# EAGLE design ms1616 (EAGLE 6.2)

## Sheet 1 of 3
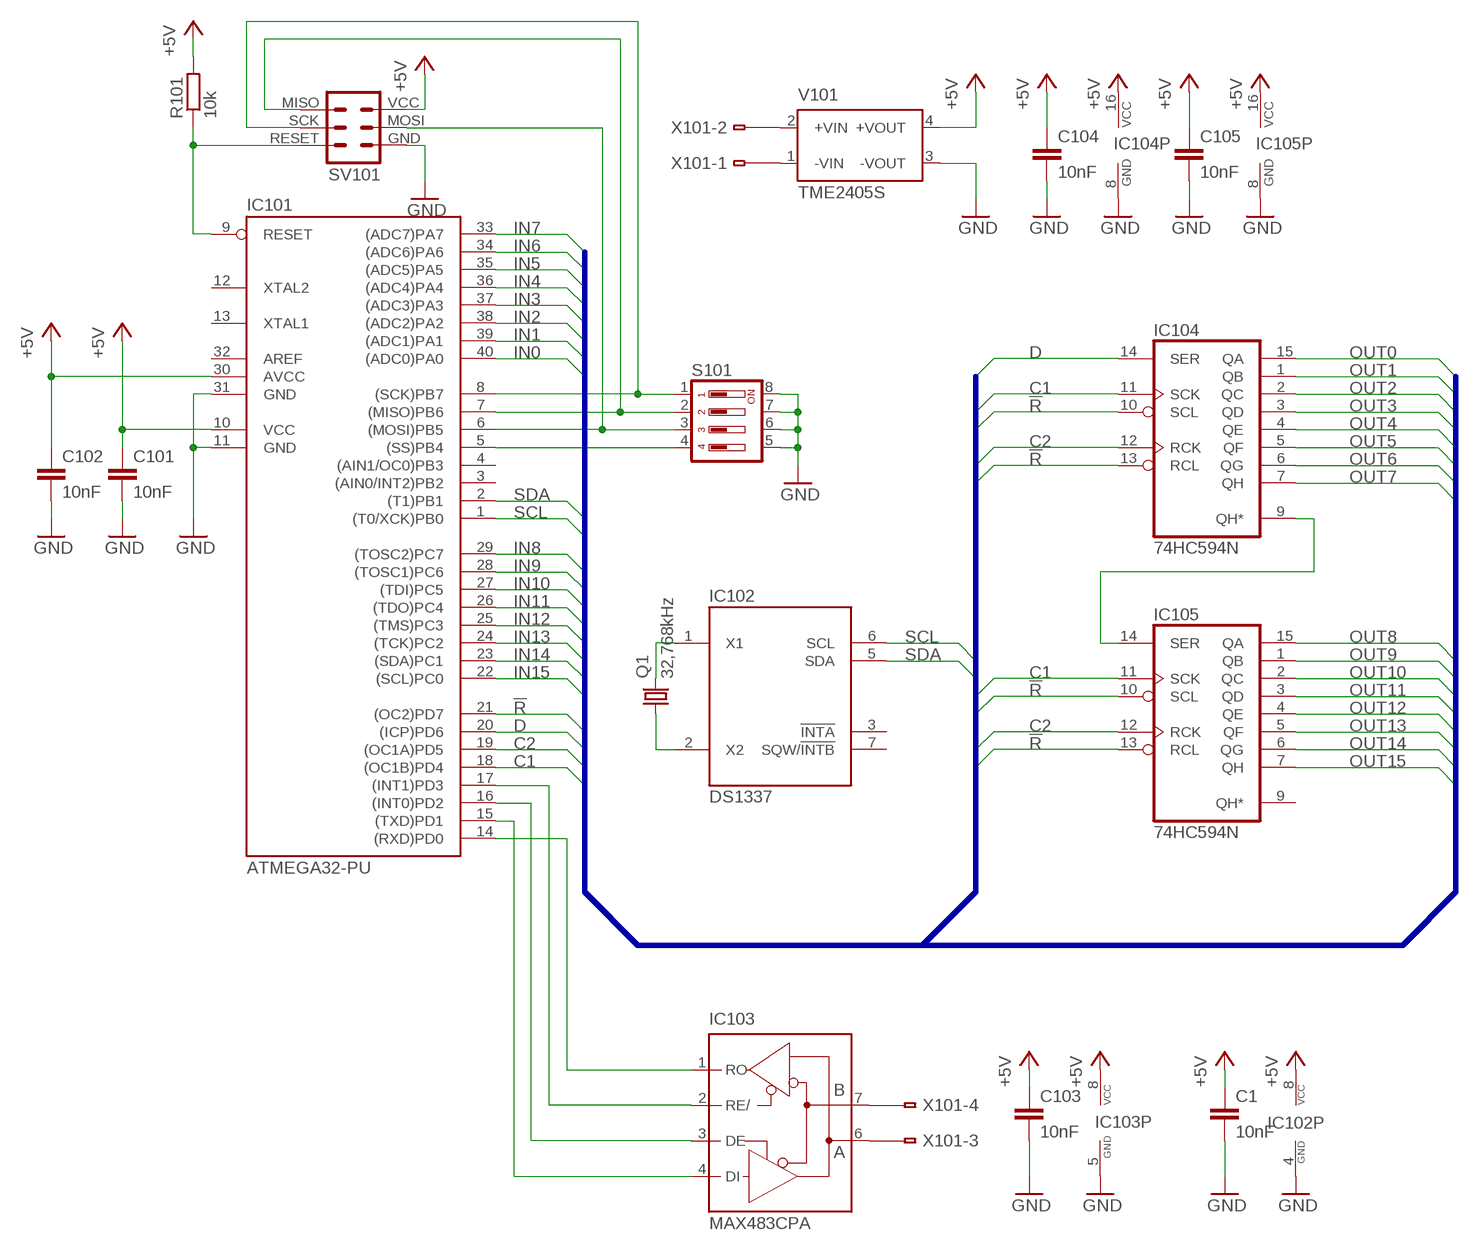
[diagram p0: schematic, sheet 1]

### Parts
C1  10nF  C_025-025X050  [C025-025X050]
C101  10nF  C_025-025X050  [C025-025X050]
C102  10nF  C_025-025X050  [C025-025X050]
C103  10nF  C_025-025X050  [C025-025X050]
C104  10nF  C_025-025X050  [C025-025X050]
C105  10nF  C_025-025X050  [C025-025X050]
IC101  ATMEGA32-PU  [DIL40]
IC102  DS1337  [DIL08]
IC103  MAX483CPA  [DIL08]
IC104  74HC594N  [DIL16]
IC105  74HC594N  [DIL16]
Q1  32,768kHz  Q_HC49S  [HC49/S]
R101  10k  R_0204/2V  [0204V]
S101  DIP04YL  [DIP04YL]
SV101  AVR_ISP6  [ML6]
V101  TME2405S  [TME-24V]
X101  233-504  [233-504]

### Nets
!R: IC101.21((OC2)PD7) IC104.10(SCL) IC104.13(RCL) IC105.10(SCL) IC105.13(RCL)
+5V: C1.1 C101.1 C102.1 C103.1 C104.1 C105.1 IC101.10(VCC) IC101.30(AVCC) IC102.8(VCC) IC103.8(VCC) IC104.16(VCC) IC105.16(VCC) R101.2 SV101.VCC V101.4(+VOUT)
C1: IC101.18((OC1B)PD4) IC104.11(SCK) IC105.11(SCK)
C2: IC101.19((OC1A)PD5) IC104.12(RCK) IC105.12(RCK)
D: IC101.20((ICP)PD6) IC104.14(SER)
GND: C1.2 C101.2 C102.2 C103.2 C104.2 C105.2 IC101.11(GND) IC101.31(GND) IC102.4(GND) IC103.5(GND) IC104.8(GND) IC105.8(GND) S101.5 S101.6 S101.7 S101.8 SV101.GND V101.3(-VOUT) ; also sheet 2,3
IN0: IC101.40((ADC0)PA0) ; also sheet 2
IN1: IC101.39((ADC1)PA1) ; also sheet 2
IN2: IC101.38((ADC2)PA2) ; also sheet 2
IN3: IC101.37((ADC3)PA3) ; also sheet 2
IN4: IC101.36((ADC4)PA4) ; also sheet 2
IN5: IC101.35((ADC5)PA5) ; also sheet 2
IN6: IC101.34((ADC6)PA6) ; also sheet 2
IN7: IC101.33((ADC7)PA7) ; also sheet 2
IN8: IC101.29((TOSC2)PC7) ; also sheet 2
IN9: IC101.28((TOSC1)PC6) ; also sheet 2
IN10: IC101.27((TDI)PC5) ; also sheet 2
IN11: IC101.26((TDO)PC4) ; also sheet 2
IN12: IC101.25((TMS)PC3) ; also sheet 2
IN13: IC101.24((TCK)PC2) ; also sheet 2
IN14: IC101.23((SDA)PC1) ; also sheet 2
IN15: IC101.22((SCL)PC0) ; also sheet 2
N$42: IC101.9(RESET) R101.1 SV101.RESET
N$58: IC104.9(QH*) IC105.14(SER)
N$59: V101.1(-VIN) X101.A1(-1:-1)
N$60: V101.2(+VIN) X101.A2(-2:-1)
N$61: IC101.15((TXD)PD1) IC103.4(DI)
N$62: IC101.14((RXD)PD0) IC103.1(RO)
N$63: IC101.17((INT1)PD3) IC103.2(RE/)
N$64: IC101.16((INT0)PD2) IC103.3(DE)
N$74: IC103.6(A) X101.A3(-3:-1)
N$122: IC101.6((MOSI)PB5) S101.3 SV101.MOSI
N$123: IC101.7((MISO)PB6) S101.2 SV101.MISO
N$124: IC103.7(B) X101.A4(-4:-1)
N$125: IC101.8((SCK)PB7) S101.1 SV101.SCK
N$126: IC102.1(X1) Q1.2
N$127: IC102.2(X2) Q1.1
N$130: IC101.5((SS)PB4) S101.4
OUT0: IC104.15(QA) ; also sheet 3
OUT1: IC104.1(QB) ; also sheet 3
OUT2: IC104.2(QC) ; also sheet 3
OUT3: IC104.3(QD) ; also sheet 3
OUT4: IC104.4(QE) ; also sheet 3
OUT5: IC104.5(QF) ; also sheet 3
OUT6: IC104.6(QG) ; also sheet 3
OUT7: IC104.7(QH) ; also sheet 3
OUT8: IC105.15(QA) ; also sheet 3
OUT9: IC105.1(QB) ; also sheet 3
OUT10: IC105.2(QC) ; also sheet 3
OUT11: IC105.3(QD) ; also sheet 3
OUT12: IC105.4(QE) ; also sheet 3
OUT13: IC105.5(QF) ; also sheet 3
OUT14: IC105.6(QG) ; also sheet 3
OUT15: IC105.7(QH) ; also sheet 3
SCL: IC101.1((T0/XCK)PB0) IC102.6(SCL)
SDA: IC101.2((T1)PB1) IC102.5(SDA)
Unconnected: IC101.3((AIN0/INT2)PB2) IC101.4((AIN1/OC0)PB3) IC101.12(XTAL2) IC101.13(XTAL1) IC101.32(AREF) IC102.3(!INTA) IC102.7(SQW/!INTB) IC105.9(QH*) X101.B1(-1:B-1) X101.B2(-2:B-1) X101.B3(-3:B-1) X101.B4(-4:B-1)

### Buses
IN[0..15],OUT[0..15],C1,C2,D,!R,SCL,SDA

## Sheet 2 of 3
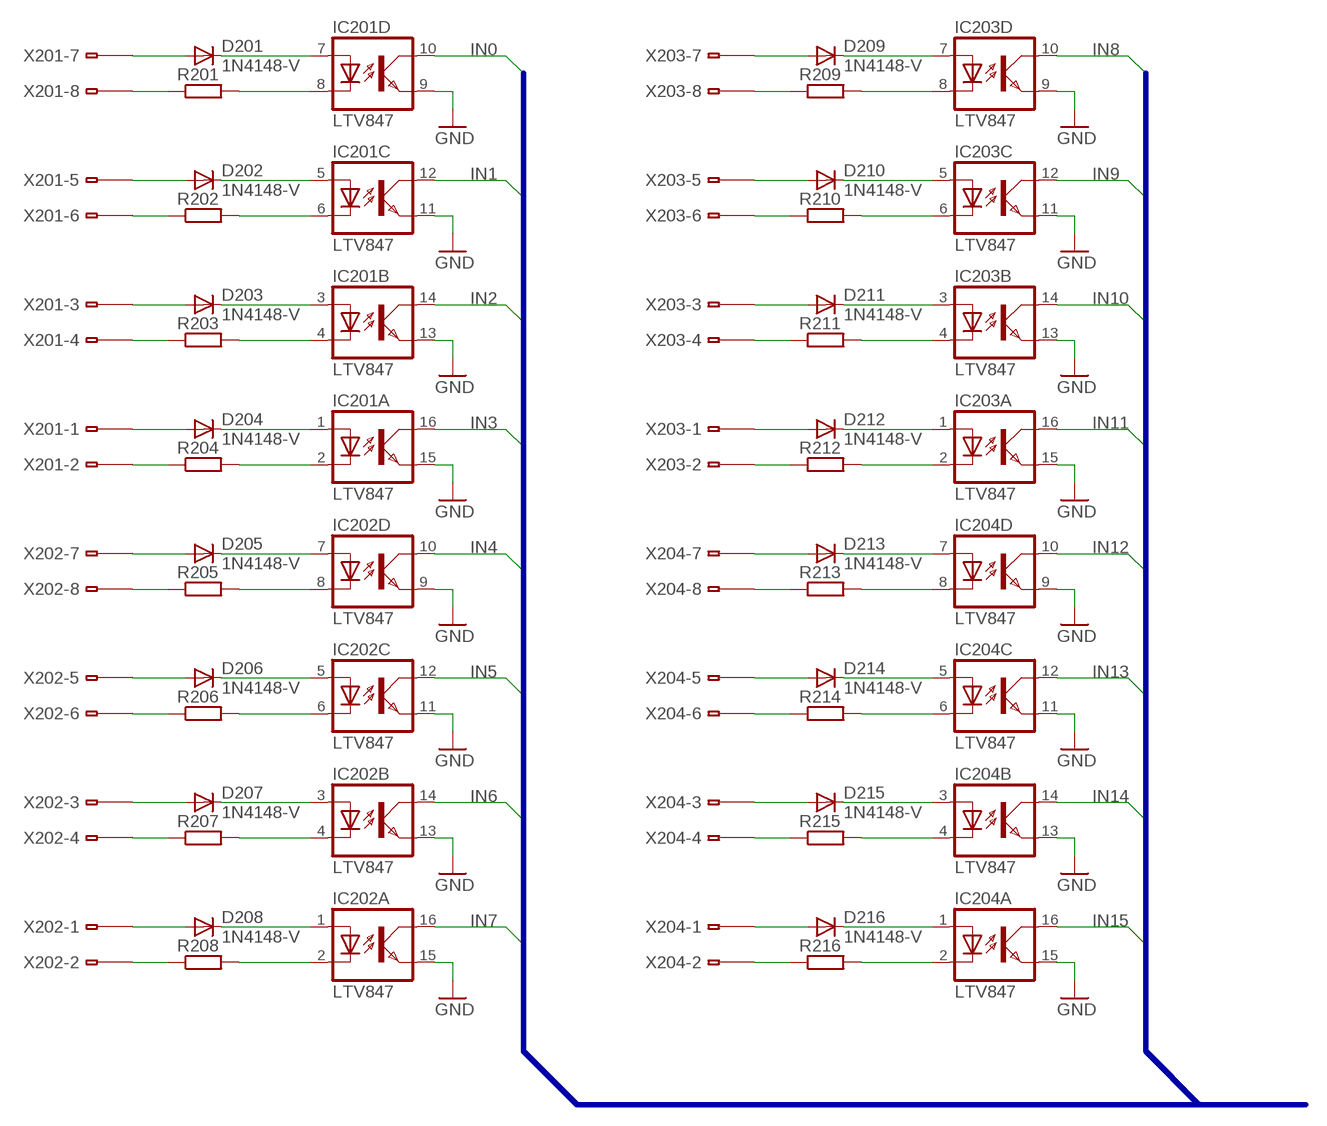
[diagram p1: schematic, sheet 2]

### Parts
D201  1N4148-V  [DO35-V]
D202  1N4148-V  [DO35-V]
D203  1N4148-V  [DO35-V]
D204  1N4148-V  [DO35-V]
D205  1N4148-V  [DO35-V]
D206  1N4148-V  [DO35-V]
D207  1N4148-V  [DO35-V]
D208  1N4148-V  [DO35-V]
D209  1N4148-V  [DO35-V]
D210  1N4148-V  [DO35-V]
D211  1N4148-V  [DO35-V]
D212  1N4148-V  [DO35-V]
D213  1N4148-V  [DO35-V]
D214  1N4148-V  [DO35-V]
D215  1N4148-V  [DO35-V]
D216  1N4148-V  [DO35-V]
IC201  LTV847  [DIL16]
IC202  LTV847  [DIL16]
IC203  LTV847  [DIL16]
IC204  LTV847  [DIL16]
R201  R_0204/2V  [0204V]
R202  R_0204/2V  [0204V]
R203  R_0204/2V  [0204V]
R204  R_0204/2V  [0204V]
R205  R_0204/2V  [0204V]
R206  R_0204/2V  [0204V]
R207  R_0204/2V  [0204V]
R208  R_0204/2V  [0204V]
R209  R_0204/2V  [0204V]
R210  R_0204/2V  [0204V]
R211  R_0204/2V  [0204V]
R212  R_0204/2V  [0204V]
R213  R_0204/2V  [0204V]
R214  R_0204/2V  [0204V]
R215  R_0204/2V  [0204V]
R216  R_0204/2V  [0204V]
X201  233-508  [233-508]
X202  233-508  [233-508]
X203  233-508  [233-508]
X204  233-508  [233-508]

### Nets
GND: IC201.9(D:EMIT) IC201.11(C:EMIT) IC201.13(B:EMIT) IC201.15(A:EMIT) IC202.9(D:EMIT) IC202.11(C:EMIT) IC202.13(B:EMIT) IC202.15(A:EMIT) IC203.9(D:EMIT) IC203.11(C:EMIT) IC203.13(B:EMIT) IC203.15(A:EMIT) IC204.9(D:EMIT) IC204.11(C:EMIT) IC204.13(B:EMIT) IC204.15(A:EMIT) ; also sheet 1,3
IN0: IC201.10(D:COL) ; also sheet 1
IN1: IC201.12(C:COL) ; also sheet 1
IN2: IC201.14(B:COL) ; also sheet 1
IN3: IC201.16(A:COL) ; also sheet 1
IN4: IC202.10(D:COL) ; also sheet 1
IN5: IC202.12(C:COL) ; also sheet 1
IN6: IC202.14(B:COL) ; also sheet 1
IN7: IC202.16(A:COL) ; also sheet 1
IN8: IC203.10(D:COL) ; also sheet 1
IN9: IC203.12(C:COL) ; also sheet 1
IN10: IC203.14(B:COL) ; also sheet 1
IN11: IC203.16(A:COL) ; also sheet 1
IN12: IC204.10(D:COL) ; also sheet 1
IN13: IC204.12(C:COL) ; also sheet 1
IN14: IC204.14(B:COL) ; also sheet 1
IN15: IC204.16(A:COL) ; also sheet 1
N$1: D201.2(C) IC201.7(D:A)
N$2: IC201.8(D:C) R201.2
N$3: D202.2(C) IC201.5(C:A)
N$4: IC201.6(C:C) R202.2
N$5: D203.2(C) IC201.3(B:A)
N$6: IC201.4(B:C) R203.2
N$7: D204.2(C) IC201.1(A:A)
N$8: IC201.2(A:C) R204.2
N$9: D205.2(C) IC202.7(D:A)
N$10: IC202.8(D:C) R205.2
N$11: D206.2(C) IC202.5(C:A)
N$12: IC202.6(C:C) R206.2
N$13: D207.2(C) IC202.3(B:A)
N$14: IC202.4(B:C) R207.2
N$15: D208.2(C) IC202.1(A:A)
N$16: IC202.2(A:C) R208.2
N$25: D209.2(C) IC203.7(D:A)
N$26: IC203.8(D:C) R209.2
N$27: D210.2(C) IC203.5(C:A)
N$28: IC203.6(C:C) R210.2
N$29: D211.2(C) IC203.3(B:A)
N$30: IC203.4(B:C) R211.2
N$31: D212.2(C) IC203.1(A:A)
N$32: IC203.2(A:C) R212.2
N$33: D213.2(C) IC204.7(D:A)
N$34: IC204.8(D:C) R213.2
N$35: D214.2(C) IC204.5(C:A)
N$36: IC204.6(C:C) R214.2
N$37: D215.2(C) IC204.3(B:A)
N$38: IC204.4(B:C) R215.2
N$39: D216.2(C) IC204.1(A:A)
N$40: IC204.2(A:C) R216.2
N$50: D204.1(A) X201.A1(-1:-1)
N$51: R204.1 X201.A2(-2:-1)
N$52: D203.1(A) X201.A3(-3:-1)
N$53: R203.1 X201.A4(-4:-1)
N$54: R202.1 X201.A6(-6:-1)
N$55: D202.1(A) X201.A5(-5:-1)
N$56: R201.1 X201.A8(-8:-1)
N$57: D201.1(A) X201.A7(-7:-1)
N$65: D205.1(A) X202.A7(-7:-1)
N$66: R205.1 X202.A8(-8:-1)
N$67: D206.1(A) X202.A5(-5:-1)
N$68: R206.1 X202.A6(-6:-1)
N$69: D207.1(A) X202.A3(-3:-1)
N$70: R207.1 X202.A4(-4:-1)
N$71: D208.1(A) X202.A1(-1:-1)
N$72: R208.1 X202.A2(-2:-1)
N$73: D216.1(A) X204.A1(-1:-1)
N$75: R216.1 X204.A2(-2:-1)
N$76: R215.1 X204.A4(-4:-1)
N$77: D215.1(A) X204.A3(-3:-1)
N$78: R214.1 X204.A6(-6:-1)
N$79: D214.1(A) X204.A5(-5:-1)
N$80: R213.1 X204.A8(-8:-1)
N$81: D213.1(A) X204.A7(-7:-1)
N$82: R212.1 X203.A2(-2:-1)
N$83: D212.1(A) X203.A1(-1:-1)
N$84: R211.1 X203.A4(-4:-1)
N$85: D211.1(A) X203.A3(-3:-1)
N$86: D209.1(A) X203.A7(-7:-1)
N$87: R209.1 X203.A8(-8:-1)
N$88: D210.1(A) X203.A5(-5:-1)
N$89: R210.1 X203.A6(-6:-1)
Unconnected: X201.B1(-1:B-1) X201.B2(-2:B-1) X201.B3(-3:B-1) X201.B4(-4:B-1) X201.B5(-5:B-1) X201.B6(-6:B-1) X201.B7(-7:B-1) X201.B8(-8:B-1) X202.B1(-1:B-1) X202.B2(-2:B-1) X202.B3(-3:B-1) X202.B4(-4:B-1) X202.B5(-5:B-1) X202.B6(-6:B-1) X202.B7(-7:B-1) X202.B8(-8:B-1) X203.B1(-1:B-1) X203.B2(-2:B-1) X203.B3(-3:B-1) X203.B4(-4:B-1) X203.B5(-5:B-1) X203.B6(-6:B-1) X203.B7(-7:B-1) X203.B8(-8:B-1) X204.B1(-1:B-1) X204.B2(-2:B-1) X204.B3(-3:B-1) X204.B4(-4:B-1) X204.B5(-5:B-1) X204.B6(-6:B-1) X204.B7(-7:B-1) X204.B8(-8:B-1)

### Buses
IN[0..15],OUT[0..7]

## Sheet 3 of 3
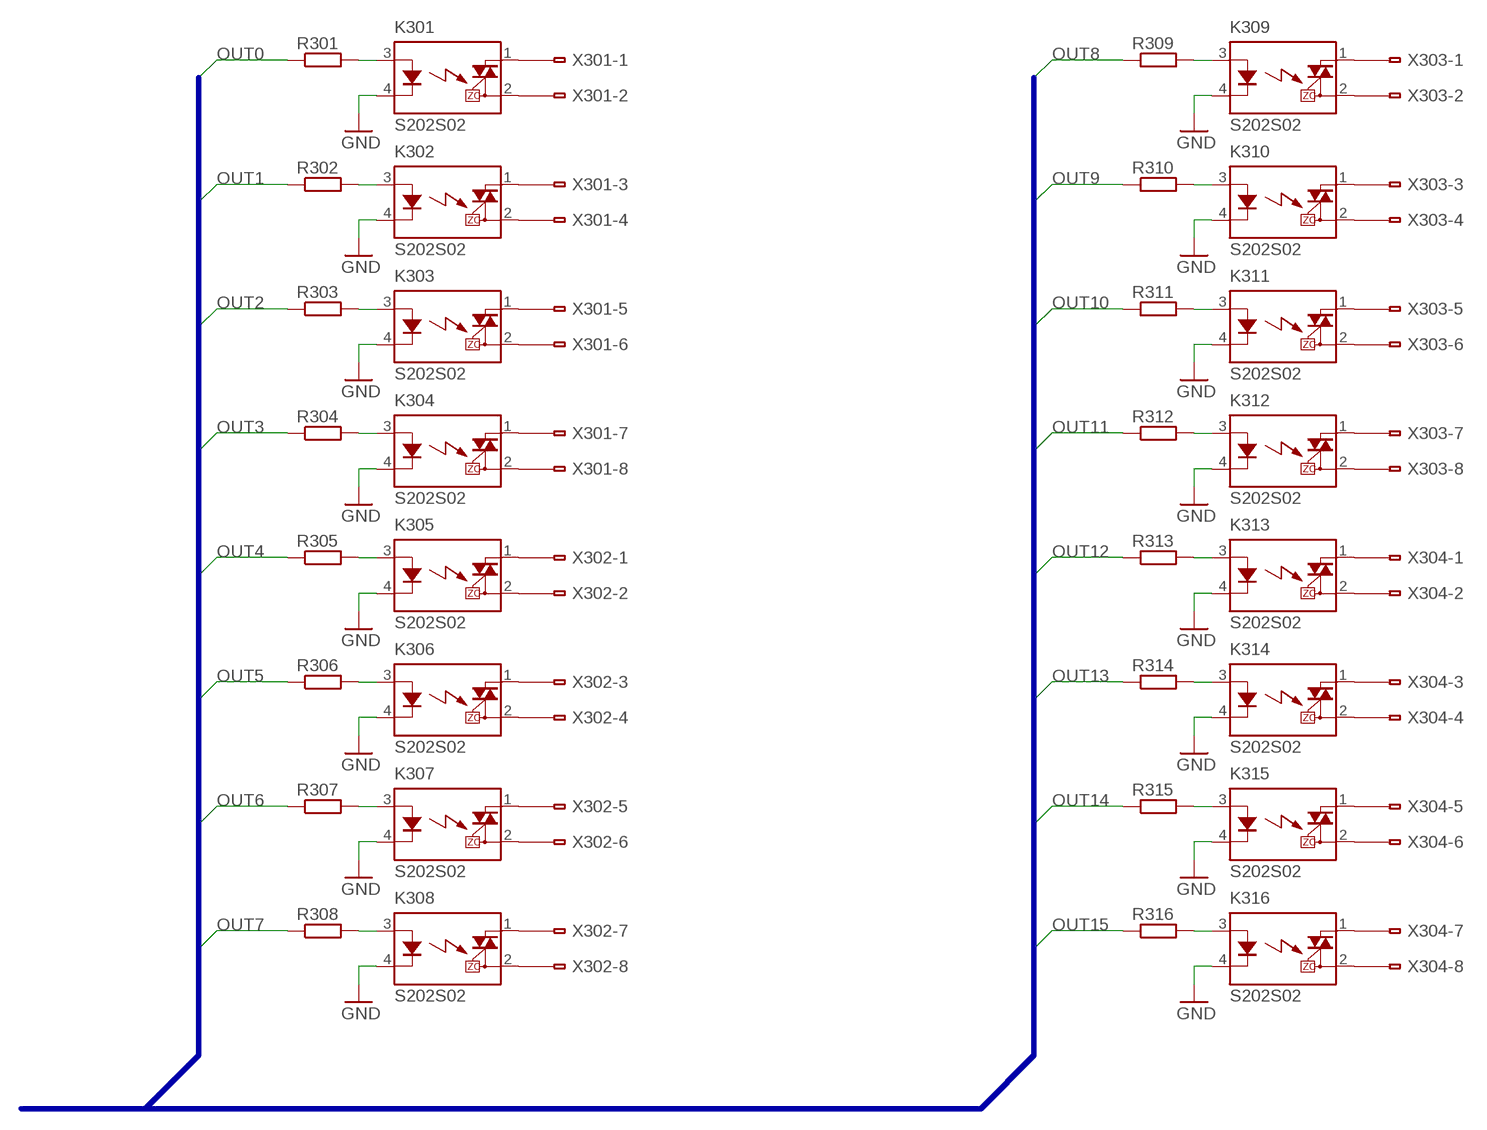
[diagram p2: schematic, sheet 3]

### Parts
K301  S202S02  [SIP4]
K302  S202S02  [SIP4]
K303  S202S02  [SIP4]
K304  S202S02  [SIP4]
K305  S202S02  [SIP4]
K306  S202S02  [SIP4]
K307  S202S02  [SIP4]
K308  S202S02  [SIP4]
K309  S202S02  [SIP4]
K310  S202S02  [SIP4]
K311  S202S02  [SIP4]
K312  S202S02  [SIP4]
K313  S202S02  [SIP4]
K314  S202S02  [SIP4]
K315  S202S02  [SIP4]
K316  S202S02  [SIP4]
R301  R_0204/2V  [0204V]
R302  R_0204/2V  [0204V]
R303  R_0204/2V  [0204V]
R304  R_0204/2V  [0204V]
R305  R_0204/2V  [0204V]
R306  R_0204/2V  [0204V]
R307  R_0204/2V  [0204V]
R308  R_0204/2V  [0204V]
R309  R_0204/2V  [0204V]
R310  R_0204/2V  [0204V]
R311  R_0204/2V  [0204V]
R312  R_0204/2V  [0204V]
R313  R_0204/2V  [0204V]
R314  R_0204/2V  [0204V]
R315  R_0204/2V  [0204V]
R316  R_0204/2V  [0204V]
X301  233-508  [233-508]
X302  233-508  [233-508]
X303  233-508  [233-508]
X304  233-508  [233-508]

### Nets
GND: K301.4(K) K302.4(K) K303.4(K) K304.4(K) K305.4(K) K306.4(K) K307.4(K) K308.4(K) K309.4(K) K310.4(K) K311.4(K) K312.4(K) K313.4(K) K314.4(K) K315.4(K) K316.4(K) ; also sheet 1,2
N$17: K301.3(A) R301.2
N$18: K302.3(A) R302.2
N$19: K303.3(A) R303.2
N$20: K304.3(A) R304.2
N$21: K305.3(A) R305.2
N$22: K306.3(A) R306.2
N$23: K307.3(A) R307.2
N$24: K308.3(A) R308.2
N$41: K309.3(A) R309.2
N$43: K310.3(A) R310.2
N$44: K311.3(A) R311.2
N$45: K312.3(A) R312.2
N$46: K313.3(A) R313.2
N$47: K314.3(A) R314.2
N$48: K315.3(A) R315.2
N$49: K316.3(A) R316.2
N$90: K301.1(DS1) X301.A1(-1:-1)
N$91: K301.2(DS2) X301.A2(-2:-1)
N$92: K302.1(DS1) X301.A3(-3:-1)
N$93: K302.2(DS2) X301.A4(-4:-1)
N$94: K303.1(DS1) X301.A5(-5:-1)
N$95: K303.2(DS2) X301.A6(-6:-1)
N$96: K304.1(DS1) X301.A7(-7:-1)
N$97: K304.2(DS2) X301.A8(-8:-1)
N$98: K305.1(DS1) X302.A1(-1:-1)
N$99: K305.2(DS2) X302.A2(-2:-1)
N$100: K306.1(DS1) X302.A3(-3:-1)
N$101: K306.2(DS2) X302.A4(-4:-1)
N$102: K307.1(DS1) X302.A5(-5:-1)
N$103: K307.2(DS2) X302.A6(-6:-1)
N$104: K308.1(DS1) X302.A7(-7:-1)
N$105: K308.2(DS2) X302.A8(-8:-1)
N$106: K309.1(DS1) X303.A1(-1:-1)
N$107: K309.2(DS2) X303.A2(-2:-1)
N$108: K310.1(DS1) X303.A3(-3:-1)
N$109: K310.2(DS2) X303.A4(-4:-1)
N$110: K311.1(DS1) X303.A5(-5:-1)
N$111: K311.2(DS2) X303.A6(-6:-1)
N$112: K312.1(DS1) X303.A7(-7:-1)
N$113: K312.2(DS2) X303.A8(-8:-1)
N$114: K313.1(DS1) X304.A1(-1:-1)
N$115: K313.2(DS2) X304.A2(-2:-1)
N$116: K314.1(DS1) X304.A3(-3:-1)
N$117: K314.2(DS2) X304.A4(-4:-1)
N$118: K315.1(DS1) X304.A5(-5:-1)
N$119: K315.2(DS2) X304.A6(-6:-1)
N$120: K316.1(DS1) X304.A7(-7:-1)
N$121: K316.2(DS2) X304.A8(-8:-1)
OUT0: R301.1 ; also sheet 1
OUT1: R302.1 ; also sheet 1
OUT2: R303.1 ; also sheet 1
OUT3: R304.1 ; also sheet 1
OUT4: R305.1 ; also sheet 1
OUT5: R306.1 ; also sheet 1
OUT6: R307.1 ; also sheet 1
OUT7: R308.1 ; also sheet 1
OUT8: R309.1 ; also sheet 1
OUT9: R310.1 ; also sheet 1
OUT10: R311.1 ; also sheet 1
OUT11: R312.1 ; also sheet 1
OUT12: R313.1 ; also sheet 1
OUT13: R314.1 ; also sheet 1
OUT14: R315.1 ; also sheet 1
OUT15: R316.1 ; also sheet 1
Unconnected: X301.B1(-1:B-1) X301.B2(-2:B-1) X301.B3(-3:B-1) X301.B4(-4:B-1) X301.B5(-5:B-1) X301.B6(-6:B-1) X301.B7(-7:B-1) X301.B8(-8:B-1) X302.B1(-1:B-1) X302.B2(-2:B-1) X302.B3(-3:B-1) X302.B4(-4:B-1) X302.B5(-5:B-1) X302.B6(-6:B-1) X302.B7(-7:B-1) X302.B8(-8:B-1) X303.B1(-1:B-1) X303.B2(-2:B-1) X303.B3(-3:B-1) X303.B4(-4:B-1) X303.B5(-5:B-1) X303.B6(-6:B-1) X303.B7(-7:B-1) X303.B8(-8:B-1) X304.B1(-1:B-1) X304.B2(-2:B-1) X304.B3(-3:B-1) X304.B4(-4:B-1) X304.B5(-5:B-1) X304.B6(-6:B-1) X304.B7(-7:B-1) X304.B8(-8:B-1)

### Buses
IN[0..15],OUT[0..7]
IN[0..15],OUT[0..15]

## Library data of the parts
C1 C101-C105 = passiv:C_: CAPACITOR, European symbol
D201-D216 = diode:1N4148: Universal Gleichrichterdiode 1n914_1n916_1n4148_1n4448.pdf <./eagle/doc/diode/1n914_1n916_1n4148_1n4448.pdf>
IC101 = ic-mcu:ATMEGA32: MICROCONTROLLER 32 Kbytes FLASH 2 Kbytes SRAM 1 Kbytes EEPROM USART 8-channel 10 bit ADC Source: www.atmel.com .. doc2503.pdf
IC102 = ic-controller:DS1337: Echtzeituhr Datasheet: ds1337.pdf <./eagle/doc/ic-controller/ds1337.pdf>
IC103 = ic-wandler:MAX48*: RS485 TRANSEIVER Datasheet: max1487-max491.pdf <./eagle/doc/ic-wandler/max1487-max491.pdf> Part Number Half- / Fullduplex Datarate (Mbps) Slew-Rate limited Low-Power shutdown Receiver / Driver enable Quiescent current (μA) Number of Receivers un bus MAX481 Half 2.5 No Yes Yes 300 32 MAX483 Half 0.25 Yes Yes Yes 120 32 MAX485 Half 2.5 No No Yes 300 32 MAX487 Half 0.25 Yes Yes Yes 120 128
IC104 IC105 = 74xx-eu:74*594: 8-bit SHIFT REGISTER, output latch
IC201-IC204 = ic-optokoppler:LTV847: Liteon Optokoppler ltv-817_827_847.pdf <./eagle/doc/ic-optokoppler/ltv-817_827_847.pdf>
K301-K316 = relais:S*02S02: IT(rms) 8A, Zero Cross type SIP 4pin Triac output SSR s102s02.pdf <./eagle/doc/relais/s102s02.pdf>; VDRM: 600
Q1 = passiv:Q_: CRYSTAL
R101 R201-R216 R301-R316 = passiv:R_: RESISTOR, European symbol
S101 = schalter:DIP04YL: DIL/CODE SWITCH; OC_FARNELL: unknown; OC_NEWARK: unknown
SV101 = stecker:AVR_ISP6: HARTING
V101 = schaltregler:TME?*: DC/DC Converter TME Series 1 Watt traco_tme.pdf <./eagle/doc/schaltregler/traco_tme.pdf>; MPN: TME 2405S; OC_FARNELL: 1007547; OC_NEWARK: 51R5329
X101 = anschlussklemmen:233-504
X201-X204 X301-X304 = anschlussklemmen:233-508: WAGO

## Board
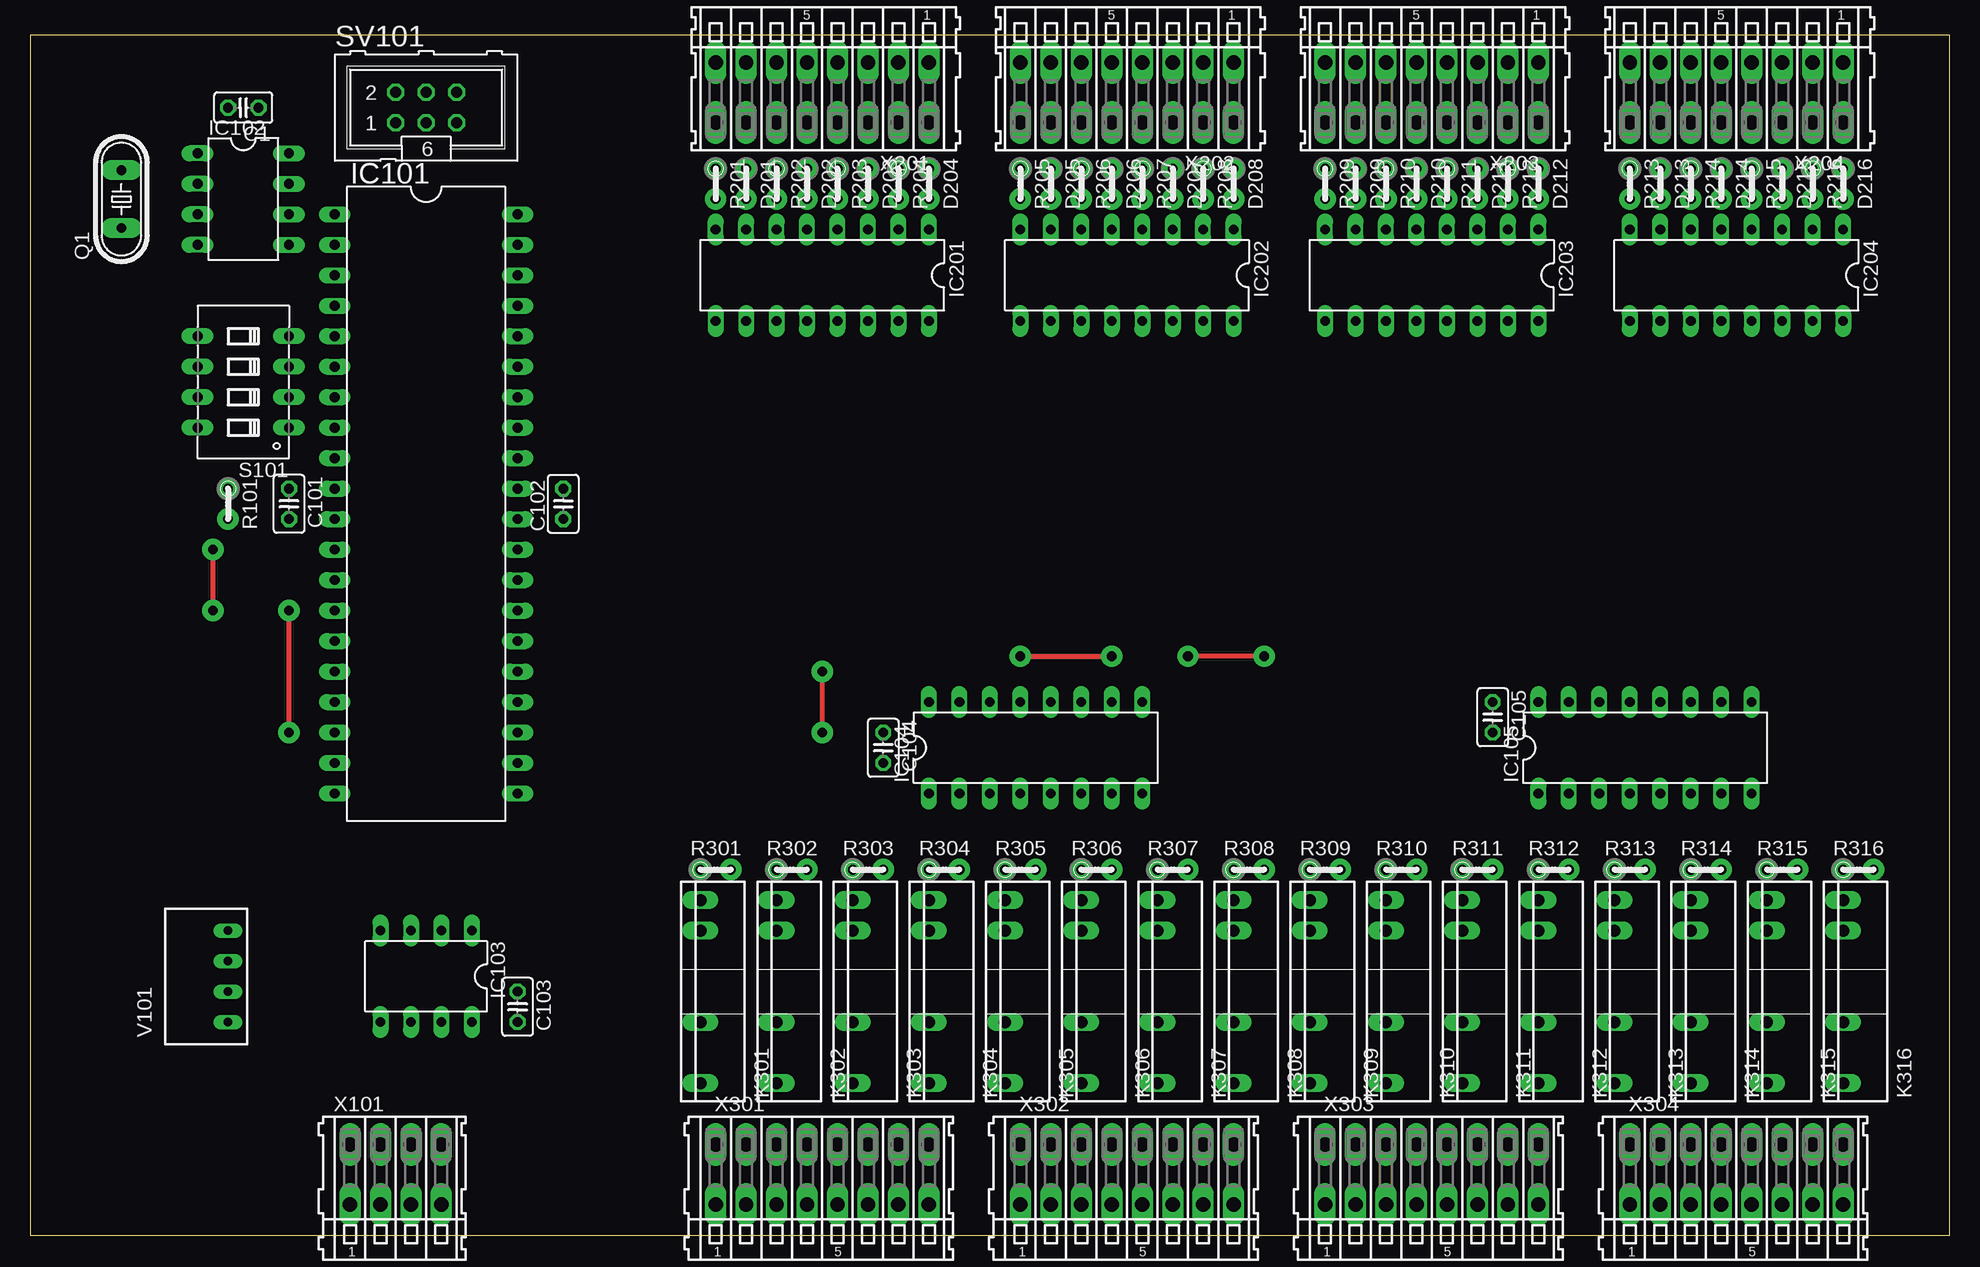
[diagram p3: board, top side]
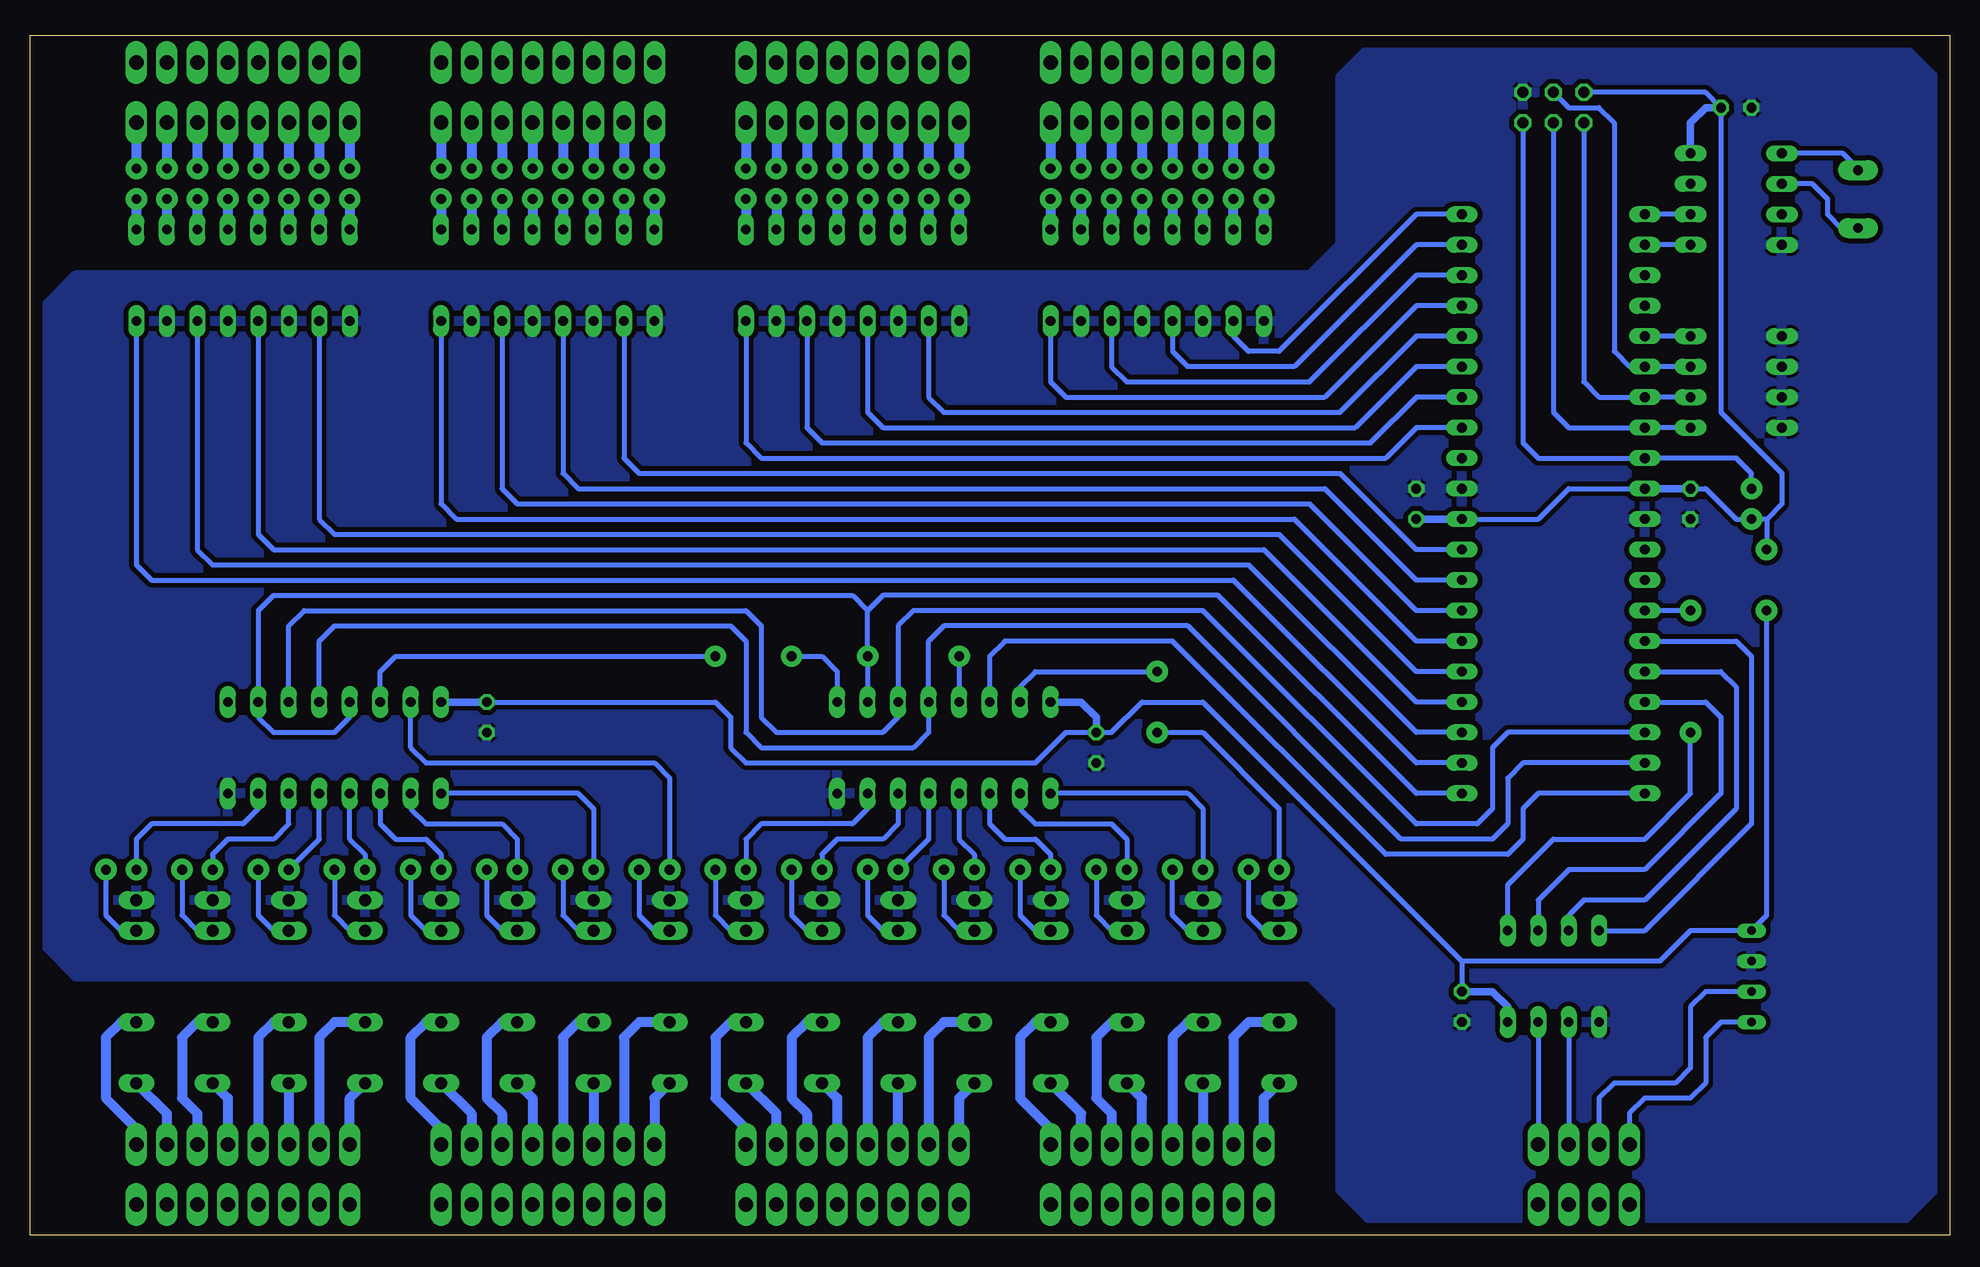
[diagram p4: board, bottom side, seen from below]

Size 160 x 100 mm. Coordinates in mm from the lower left corner, seen from the top.
Outline: 0,0 160,0 160,100 0,100 0,0
Copper layers (1*16): Top 0.035mm / dielectric 1.5mm / Bottom 0.035mm
Design rules: minimum track width 10mil, minimum drill 24mil, track to track 8mil, track to pad 8mil, pad to pad 8mil, via to via 8mil, smd to smd 8mil, copper to edge 40mil, drill to drill 8mil, minimum pad ring 10mil, minimum via ring 8mil, stop-mask expansion 4mil, vias tented up to drill 0mil, thermal gap 10mil

### Footprints (pad centres in the part's own frame; a part is rotated, then mirrored left to right if it is on the bottom)
C025-025X050 = drill 0.813 octagon: 1 -1.27,0; 2 1.27,0
DO35-V = drill 0.813 pad 1.778: 1 -1.27,0; 2 1.27,0
DIL40 = drill 0.813 long: 1 -24.13,-7.62; 2 -21.59,-7.62; 3 -19.05,-7.62; 4 -16.51,-7.62; 5 -13.97,-7.62; 6 -11.43,-7.62; 7 -8.89,-7.62; 8 -6.35,-7.62; 9 -3.81,-7.62; 10 -1.27,-7.62; 11 1.27,-7.62; 12 3.81,-7.62; 13 6.35,-7.62; 14 8.89,-7.62; 15 11.43,-7.62; 16 13.97,-7.62; 17 16.51,-7.62; 18 19.05,-7.62; 19 21.59,-7.62; 20 24.13,-7.62; 21 24.13,7.62; 22 21.59,7.62; 23 19.05,7.62; 24 16.51,7.62; 25 13.97,7.62; 26 11.43,7.62; 27 8.89,7.62; 28 6.35,7.62; 29 3.81,7.62; 30 1.27,7.62; 31 -1.27,7.62; 32 -3.81,7.62; 33 -6.35,7.62; 34 -8.89,7.62; 35 -11.43,7.62; 36 -13.97,7.62; 37 -16.51,7.62; 38 -19.05,7.62; 39 -21.59,7.62; 40 -24.13,7.62
DIL08 = drill 0.813 long: 1 -3.81,-3.81; 2 -1.27,-3.81; 3 1.27,-3.81; 4 3.81,-3.81; 5 3.81,3.81; 6 1.27,3.81; 7 -1.27,3.81; 8 -3.81,3.81
DIL16 = drill 0.813 long: 1 -8.89,-3.81; 2 -6.35,-3.81; 3 -3.81,-3.81; 4 -1.27,-3.81; 5 1.27,-3.81; 6 3.81,-3.81; 7 6.35,-3.81; 8 8.89,-3.81; 9 8.89,3.81; 10 6.35,3.81; 11 3.81,3.81; 12 1.27,3.81; 13 -1.27,3.81; 14 -3.81,3.81; 15 -6.35,3.81; 16 -8.89,3.81
SIP4 = drill 1 long: 1 -7.62,0; 2 -2.54,0; 3 5.08,0; 4 7.62,0
HC49/S = drill 0.813 pad 1.676 long: 1 -2.413,0; 2 2.413,0
0204V = drill 0.813 pad 1.778: 1 -1.27,0; 2 1.27,0
DIP04YL = drill 0.813 long: 1 -3.81,-3.81; 2 -1.27,-3.81; 3 1.27,-3.81; 4 3.81,-3.81; 5 3.81,3.81; 6 1.27,3.81; 7 -1.27,3.81; 8 -3.81,3.81
ML6 = drill 0.914 octagon: GND 2.54,1.27; MISO -2.54,-1.27; MOSI 0,1.27; RESET 2.54,-1.27; SCK 0,-1.27; VCC -2.54,1.27
TME-24V = drill 0.7 pad 1.1 long: 1 -3.81,0; 2 -1.27,0; 3 1.27,0; 4 3.81,0
233-504 = drill 1.2 long: A1 -3.81,2.5; A2 -1.27,2.5; A3 1.27,2.5; A4 3.81,2.5; B1 -3.81,-2.5; B2 -1.27,-2.5; B3 1.27,-2.5; B4 3.81,-2.5
233-508 = drill 1.2 long: A1 -8.89,2.5; A2 -6.35,2.5; A3 -3.81,2.5; A4 -1.27,2.5; A5 1.27,2.5; A6 3.81,2.5; A7 6.35,2.5; A8 8.89,2.5; B1 -8.89,-2.5; B2 -6.35,-2.5; B3 -3.81,-2.5; B4 -1.27,-2.5; B5 1.27,-2.5; B6 3.81,-2.5; B7 6.35,-2.5; B8 8.89,-2.5

### Placement (x,y rotation side)
C1  17.78,93.98 180 top
C101  21.59,60.96 270 top
C102  44.45,60.96 90 top
C103  40.64,19.05 270 top
C104  71.12,40.64 270 top
C105  121.92,43.18 270 top
D201  59.69,87.63 270 top
D202  64.77,87.63 270 top
D203  69.85,87.63 270 top
D204  74.93,87.63 270 top
D205  85.09,87.63 270 top
D206  90.17,87.63 270 top
D207  95.25,87.63 270 top
D208  100.33,87.63 270 top
D209  110.49,87.63 270 top
D210  115.57,87.63 270 top
D211  120.65,87.63 270 top
D212  125.73,87.63 270 top
D213  135.89,87.63 270 top
D214  140.97,87.63 270 top
D215  146.05,87.63 270 top
D216  151.13,87.63 270 top
IC101  33.02,60.96 270 top
IC102  17.78,86.36 270 top
IC103  33.02,21.59 180 top
IC104  83.82,40.64 0 top
IC105  134.62,40.64 0 top
IC201  66.04,80.01 180 top
IC202  91.44,80.01 180 top
IC203  116.84,80.01 180 top
IC204  142.24,80.01 180 top
K301  55.88,20.32 90 top
K302  62.23,20.32 90 top
K303  68.58,20.32 90 top
K304  74.93,20.32 90 top
K305  81.28,20.32 90 top
K306  87.63,20.32 90 top
K307  93.98,20.32 90 top
K308  100.33,20.32 90 top
K309  106.68,20.32 90 top
K310  113.03,20.32 90 top
K311  119.38,20.32 90 top
K312  125.73,20.32 90 top
K313  132.08,20.32 90 top
K314  138.43,20.32 90 top
K315  144.78,20.32 90 top
K316  151.13,20.32 90 top
Q1  7.62,86.36 90 top
R101  16.51,60.96 270 top
R201  57.15,87.63 270 top
R202  62.23,87.63 270 top
R203  67.31,87.63 270 top
R204  72.39,87.63 270 top
R205  82.55,87.63 270 top
R206  87.63,87.63 270 top
R207  92.71,87.63 270 top
R208  97.79,87.63 270 top
R209  107.95,87.63 270 top
R210  113.03,87.63 270 top
R211  118.11,87.63 270 top
R212  123.19,87.63 270 top
R213  133.35,87.63 270 top
R214  138.43,87.63 270 top
R215  143.51,87.63 270 top
R216  148.59,87.63 270 top
R301  57.15,30.48 0 top
R302  63.5,30.48 0 top
R303  69.85,30.48 0 top
R304  76.2,30.48 0 top
R305  82.55,30.48 0 top
R306  88.9,30.48 0 top
R307  95.25,30.48 0 top
R308  101.6,30.48 0 top
R309  107.95,30.48 0 top
R310  114.3,30.48 0 top
R311  120.65,30.48 0 top
R312  127,30.48 0 top
R313  133.35,30.48 0 top
R314  139.7,30.48 0 top
R315  146.05,30.48 0 top
R316  152.4,30.48 0 top
S101  17.78,71.12 90 top
SV101  33.02,93.98 0 top
V101  16.51,21.59 90 top
X101  30.48,5.08 0 top
X201  66.04,95.25 180 top
X202  91.44,95.25 180 top
X203  116.84,95.25 180 top
X204  142.24,95.25 180 top
X301  66.04,5.08 0 top
X302  91.44,5.08 0 top
X303  116.84,5.08 0 top
X304  142.24,5.08 0 top

### Tracks (layer width: path | path; a pad name or v marks a point on that pad's centre or on a via)
!R  (via drill 0.8 pad 1.78)
  Top 0.406: v82.55,48.26 v90.17,48.26
  Bottom 0.406: IC101.21 44.45,36.83 60.96,53.34 88.9,53.34 90.17,52.07 | 90.17,52.07 91.44,53.34 139.7,53.34 140.97,52.07 IC105.10 140.97,43.18 139.7,41.91 134.62,41.91 133.35,43.18 IC105.13 | 90.17,52.07 v90.17,48.26 IC104.10 | v82.55,48.26 IC104.13
+5V  (via drill 0.8 pad 1.78)
  Top 0.406: v15.24,57.15 v15.24,52.07
  Bottom 0.406: IC101.10 31.75,62.23 34.29,59.69 IC101.30 | v15.24,52.07 15.24,26.67 V101.4 21.59,25.4 24.13,22.86 40.64,22.86 | 40.64,22.86 C103.1 | 40.64,22.86 62.23,44.45 67.31,44.45 69.85,41.91 C104.1 73.66,41.91 76.2,39.37 100.33,39.37 101.6,40.64 101.6,43.18 102.87,44.45 C105.1 | C101.1 20.32,62.23 17.78,59.69 R101.2 15.24,59.69 | 15.24,59.69 13.97,60.96 13.97,63.5 19.05,68.58 C1.1 20.32,95.25 SV101.VCC | 15.24,59.69 v15.24,57.15
  Bottom 0.61: IC101.30 C102.1 | IC101.10 C101.1 | C104.1 71.12,43.18 72.39,44.45 IC104.16 | C103.1 38.1,20.32 36.83,19.05 IC103.8 | C105.1 IC105.16 | C1.1 20.32,93.98 21.59,92.71 IC102.8
C1
  Bottom 0.406: IC101.18 36.83,41.91 38.1,40.64 38.1,35.56 39.37,34.29 44.45,34.29 62.23,52.07 86.36,52.07 87.63,50.8 IC104.11 87.63,43.18 88.9,41.91 97.79,41.91 99.06,43.18 99.06,50.8 100.33,52.07 137.16,52.07 138.43,50.8 IC105.11
C2
  Bottom 0.406: IC101.19 35.56,39.37 36.83,38.1 36.83,34.29 38.1,33.02 45.72,33.02 63.5,50.8 83.82,50.8 85.09,49.53 IC104.12 85.09,41.91 86.36,40.64 99.06,40.64 100.33,41.91 100.33,49.53 101.6,50.8 134.62,50.8 135.89,49.53 IC105.12
D
  Bottom 0.406: IC101.20 34.29,36.83 35.56,35.56 35.56,33.02 36.83,31.75 46.99,31.75 64.77,49.53 78.74,49.53 80.01,48.26 IC104.14
GND
  pour Bottom (isolate 0.406): 3.81,99.06 48.26,99.06 50.8,96.52 50.8,82.55 53.34,80.01 156.21,80.01 158.75,77.47 158.75,24.13 156.21,21.59 53.34,21.59 50.8,19.05 50.8,3.81 48.26,1.27 3.81,1.27 1.27,3.81 1.27,96.52
IN0
  Bottom 0.406: IC201.10 59.69,74.93 58.42,73.66 55.88,73.66 44.45,85.09 IC101.40
IN1
  Bottom 0.406: IC201.12 64.77,73.66 63.5,72.39 54.61,72.39 44.45,82.55 IC101.39
IN2
  Bottom 0.406: IC201.14 69.85,72.39 68.58,71.12 53.34,71.12 44.45,80.01 IC101.38
IN3
  Bottom 0.406: IC201.16 74.93,71.12 73.66,69.85 52.07,69.85 44.45,77.47 IC101.37
IN4
  Bottom 0.406: IC202.10 85.09,69.85 83.82,68.58 50.8,68.58 44.45,74.93 IC101.36
IN5
  Bottom 0.406: IC202.12 90.17,68.58 88.9,67.31 49.53,67.31 44.45,72.39 IC101.35
IN6
  Bottom 0.406: IC202.14 95.25,67.31 93.98,66.04 48.26,66.04 44.45,69.85 IC101.34
IN7
  Bottom 0.406: IC202.16 100.33,66.04 99.06,64.77 46.99,64.77 44.45,67.31 IC101.33
IN8
  Bottom 0.406: IC203.10 110.49,64.77 109.22,63.5 50.8,63.5 44.45,57.15 IC101.29
IN9
  Bottom 0.406: IC203.12 115.57,63.5 114.3,62.23 52.07,62.23 44.45,54.61 IC101.28
IN10
  Bottom 0.406: IC203.14 120.65,62.23 119.38,60.96 53.34,60.96 44.45,52.07 IC101.27
IN11
  Bottom 0.406: IC203.16 125.73,60.96 124.46,59.69 54.61,59.69 44.45,49.53 IC101.26
IN12
  Bottom 0.406: IC204.10 135.89,59.69 134.62,58.42 55.88,58.42 44.45,46.99 IC101.25
IN13
  Bottom 0.406: IC204.12 140.97,58.42 139.7,57.15 57.15,57.15 44.45,44.45 IC101.24
IN14
  Bottom 0.406: IC204.14 146.05,57.15 144.78,55.88 58.42,55.88 44.45,41.91 IC101.23
IN15
  Bottom 0.406: IC204.16 151.13,55.88 149.86,54.61 59.69,54.61 44.45,39.37 IC101.22
N$1
  Bottom 0.813: IC201.7 D201.2
N$2
  Bottom 0.813: IC201.8 R201.2
N$3
  Bottom 0.813: D202.2 IC201.5
N$4
  Bottom 0.813: IC201.6 R202.2
N$5
  Bottom 0.813: D203.2 IC201.3
N$6
  Bottom 0.813: R203.2 IC201.4
N$7
  Bottom 0.813: D204.2 IC201.1
N$8
  Bottom 0.813: R204.2 IC201.2
N$9
  Bottom 0.813: D205.2 IC202.7
N$10
  Bottom 0.813: R205.2 IC202.8
N$11
  Bottom 0.813: D206.2 IC202.5
N$12
  Bottom 0.813: R206.2 IC202.6
N$13
  Bottom 0.813: D207.2 IC202.3
N$14
  Bottom 0.813: R207.2 IC202.4
N$15
  Bottom 0.813: D208.2 IC202.1
N$16
  Bottom 0.813: R208.2 IC202.2
N$17
  Bottom 0.406: R301.2 58.42,26.67 57.15,25.4 K301.3
N$18
  Bottom 0.406: K302.3 63.5,25.4 64.77,26.67 R302.2
N$19
  Bottom 0.406: R303.2 71.12,26.67 69.85,25.4 K303.3
N$20
  Bottom 0.406: R304.2 77.47,26.67 76.2,25.4 K304.3
N$21
  Bottom 0.406: R305.2 83.82,26.67 82.55,25.4 K305.3
N$22
  Bottom 0.406: R306.2 90.17,26.67 88.9,25.4 K306.3
N$23
  Bottom 0.406: R307.2 96.52,26.67 95.25,25.4 K307.3
N$24
  Bottom 0.406: R308.2 102.87,26.67 101.6,25.4 K308.3
N$25
  Bottom 0.813: D209.2 IC203.7
N$26
  Bottom 0.813: R209.2 IC203.8
N$27
  Bottom 0.813: D210.2 IC203.5
N$28
  Bottom 0.813: R210.2 IC203.6
N$29
  Bottom 0.813: D211.2 IC203.3
N$30
  Bottom 0.813: R211.2 IC203.4
N$31
  Bottom 0.813: D212.2 IC203.1
N$32
  Bottom 0.813: R212.2 IC203.2
N$33
  Bottom 0.813: D213.2 IC204.7
N$34
  Bottom 0.813: R213.2 IC204.8
N$35
  Bottom 0.813: D214.2 IC204.5
N$36
  Bottom 0.813: R214.2 IC204.6
N$37
  Bottom 0.813: D215.2 IC204.3
N$38
  Bottom 0.813: R215.2 IC204.4
N$39
  Bottom 0.813: D216.2 IC204.1
N$40
  Bottom 0.813: R216.2 IC204.2
N$41
  Bottom 0.406: R309.2 109.22,26.67 107.95,25.4 K309.3
N$42
  Bottom 0.406: SV101.RESET 35.56,66.04 34.29,64.77 IC101.9 17.78,64.77 16.51,63.5 R101.1
N$43
  Bottom 0.406: R310.2 115.57,26.67 114.3,25.4 K310.3
N$44
  Bottom 0.406: R311.2 121.92,26.67 120.65,25.4 K311.3
N$45
  Bottom 0.406: R312.2 128.27,26.67 127,25.4 K312.3
N$46
  Bottom 0.406: R313.2 134.62,26.67 133.35,25.4 K313.3
N$47
  Bottom 0.406: R314.2 140.97,26.67 139.7,25.4 K314.3
N$48
  Bottom 0.406: R315.2 147.32,26.67 146.05,25.4 K315.3
N$49
  Bottom 0.406: R316.2 153.67,26.67 152.4,25.4 K316.3
N$50
  Bottom 0.813: X201.A1 D204.1
N$51
  Bottom 0.813: X201.A2 R204.1
N$52
  Bottom 0.813: X201.A3 D203.1
N$53
  Bottom 0.813: X201.A4 R203.1
N$54
  Bottom 0.813: X201.A6 R202.1
N$55
  Bottom 0.813: X201.A5 D202.1
N$56
  Bottom 0.813: R201.1 X201.A8
N$57
  Bottom 0.813: D201.1 X201.A7
N$58  (via drill 0.8 pad 1.78)
  Top 0.406: v102.87,48.26 v96.52,48.26
  Bottom 0.406: IC105.14 130.81,46.99 129.54,48.26 v102.87,48.26 | v96.52,48.26 93.98,48.26 92.71,46.99 IC104.9
N$59
  Bottom 0.406: V101.1 19.05,17.78 20.32,16.51 20.32,12.7 21.59,11.43 25.4,11.43 26.67,10.16 X101.A1
N$60
  Bottom 0.406: V101.2 20.32,20.32 21.59,19.05 21.59,13.97 22.86,12.7 27.94,12.7 29.21,11.43 X101.A2
N$61
  Bottom 0.406: IC101.15 17.78,49.53 16.51,48.26 16.51,34.29 25.4,25.4 IC103.4
N$62  (via drill 0.8 pad 1.78)
  Top 0.406: v21.59,41.91 v21.59,52.07
  Bottom 0.406: IC103.1 36.83,29.21 33.02,33.02 25.4,33.02 21.59,36.83 v21.59,41.91 | v21.59,52.07 IC101.14
N$63
  Bottom 0.406: IC101.17 20.32,44.45 19.05,43.18 19.05,36.83 25.4,30.48 31.75,30.48 34.29,27.94 IC103.2
N$64
  Bottom 0.406: IC101.16 19.05,46.99 17.78,45.72 17.78,35.56 25.4,27.94 30.48,27.94 31.75,26.67 IC103.3
N$65
  Bottom 0.813: X202.A7 D205.1
N$66
  Bottom 0.813: X202.A8 R205.1
N$67
  Bottom 0.813: X202.A5 D206.1
N$68
  Bottom 0.813: X202.A6 R206.1
N$69
  Bottom 0.813: X202.A3 D207.1
N$70
  Bottom 0.813: X202.A4 R207.1
N$71
  Bottom 0.813: X202.A1 D208.1
N$72
  Bottom 0.813: X202.A2 R208.1
N$73
  Bottom 0.813: X204.A1 D216.1
N$74
  Bottom 0.406: IC103.6 X101.A3
N$75
  Bottom 0.813: X204.A2 R216.1
N$76
  Bottom 0.813: X204.A4 R215.1
N$77
  Bottom 0.813: X204.A3 D215.1
N$78
  Bottom 0.813: X204.A6 R214.1
N$79
  Bottom 0.813: X204.A5 D214.1
N$80
  Bottom 0.813: X204.A8 R213.1
N$81
  Bottom 0.813: X204.A7 D213.1
N$82
  Bottom 0.813: X203.A2 R212.1
N$83
  Bottom 0.813: X203.A1 D212.1
N$84
  Bottom 0.813: X203.A4 R211.1
N$85
  Bottom 0.813: X203.A3 D211.1
N$86
  Bottom 0.813: X203.A7 D209.1
N$87
  Bottom 0.813: X203.A8 R209.1
N$88
  Bottom 0.813: X203.A5 D210.1
N$89
  Bottom 0.813: X203.A6 R210.1
N$90
  Bottom 0.813: X301.A1 57.15,11.43 K301.1
N$91
  Bottom 0.813: K301.2 58.42,17.78 59.69,16.51 X301.A2
N$92
  Bottom 0.813: K302.1 X301.A3
N$93
  Bottom 0.813: K302.2 63.5,17.78 64.77,16.51 X301.A4
N$94
  Bottom 0.813: X301.A5 67.31,11.43 K303.1
N$95
  Bottom 0.813: K303.2 69.85,17.78 71.12,16.51 71.12,11.43 69.85,10.16 X301.A6
N$96
  Bottom 0.813: X301.A7 72.39,10.16 K304.1
N$97
  Bottom 0.813: K304.2 76.2,17.78 77.47,16.51 77.47,11.43 74.93,8.89 X301.A8
N$98
  Bottom 0.813: K305.1 82.55,11.43 X302.A1
N$99
  Bottom 0.813: K305.2 83.82,17.78 85.09,16.51 X302.A2
N$100
  Bottom 0.813: X302.A3 K306.1
N$101
  Bottom 0.813: K306.2 88.9,17.78 90.17,16.51 X302.A4
N$102
  Bottom 0.813: K307.1 92.71,11.43 X302.A5
N$103
  Bottom 0.813: K307.2 95.25,17.78 96.52,16.51 96.52,11.43 95.25,10.16 X302.A6
N$104
  Bottom 0.813: X302.A7 97.79,10.16 K308.1
N$105
  Bottom 0.813: K308.2 101.6,17.78 102.87,16.51 102.87,11.43 100.33,8.89 X302.A8
N$106
  Bottom 0.813: K309.1 107.95,11.43 X303.A1
N$107
  Bottom 0.813: K309.2 109.22,17.78 110.49,16.51 X303.A2
N$108
  Bottom 0.813: K310.1 X303.A3
N$109
  Bottom 0.813: K310.2 114.3,17.78 115.57,16.51 115.57,8.89 115.57,7.62 X303.A4
N$110
  Bottom 0.813: K311.1 118.11,11.43 X303.A5
N$111
  Bottom 0.813: K311.2 120.65,17.78 121.92,16.51 121.92,11.43 120.65,10.16 X303.A6
N$112
  Bottom 0.813: K312.1 123.19,10.16 X303.A7
N$113
  Bottom 0.813: X303.A8 125.73,8.89 128.27,11.43 128.27,16.51 127,17.78 K312.2
N$114
  Bottom 0.813: X304.A1 133.35,11.43 K313.1
N$115
  Bottom 0.813: K313.2 134.62,17.78 135.89,16.51 X304.A2
N$116
  Bottom 0.813: K314.1 X304.A3
N$117
  Bottom 0.813: K314.2 139.7,17.78 140.97,16.51 X304.A4
N$118
  Bottom 0.813: K315.1 143.51,11.43 X304.A5
N$119
  Bottom 0.813: K315.2 146.05,17.78 147.32,16.51 147.32,11.43 146.05,10.16 X304.A6
N$120
  Bottom 0.813: K316.1 148.59,10.16 X304.A7
N$121
  Bottom 0.813: K316.2 152.4,17.78 153.67,16.51 153.67,11.43 151.13,8.89 X304.A8
N$122
  Bottom 0.406: SV101.MOSI 31.75,93.98 29.21,93.98 27.94,92.71 27.94,73.66 26.67,72.39 IC101.6 S101.3
N$123
  Bottom 0.406: SV101.MISO 30.48,71.12 29.21,69.85 IC101.7 S101.2
N$124
  Bottom 0.406: IC103.7 X101.A4
N$125
  Bottom 0.406: SV101.SCK 33.02,68.58 31.75,67.31 IC101.8 S101.1
N$126
  Bottom 0.406: Q1.2 7.62,88.9 8.89,90.17 IC102.1
N$127
  Bottom 0.406: Q1.1 9.02,83.95 10.16,85.09 10.16,86.36 11.43,87.63 IC102.2
N$130
  Bottom 0.406: S101.4 IC101.5
OUT0  (via drill 0.8 pad 1.78)
  Top 0.406: v66.04,46.99 v66.04,41.91
  Bottom 0.406: v66.04,46.99 76.2,46.99 77.47,45.72 IC104.15 | v66.04,41.91 62.23,41.91 55.88,35.56 R301.1
OUT1
  Bottom 0.406: R302.1 62.23,35.56 63.5,36.83 IC104.1
OUT2
  Bottom 0.406: R303.1 68.58,33.02 69.85,34.29 76.2,34.29 77.47,35.56 IC104.2
OUT3
  Bottom 0.406: R304.1 74.93,31.75 76.2,33.02 78.74,33.02 80.01,34.29 IC104.3
OUT4
  Bottom 0.406: R305.1 81.28,31.75 82.55,33.02 IC104.4
OUT5
  Bottom 0.406: R306.1 85.09,33.02 IC104.5
OUT6
  Bottom 0.406: R307.1 93.98,31.75 92.71,33.02 88.9,33.02 87.63,34.29 IC104.6
OUT7
  Bottom 0.406: R308.1 100.33,33.02 99.06,34.29 91.44,34.29 90.17,35.56 IC104.7
OUT8
  Bottom 0.406: R309.1 106.68,38.1 107.95,39.37 127,39.37 128.27,40.64 IC105.15
OUT9
  Bottom 0.406: R310.1 113.03,35.56 114.3,36.83 IC105.1
OUT10
  Bottom 0.406: R311.1 119.38,33.02 120.65,34.29 127,34.29 128.27,35.56 IC105.2
OUT11
  Bottom 0.406: R312.1 125.73,31.75 127,33.02 129.54,33.02 130.81,34.29 IC105.3
OUT12
  Bottom 0.406: R313.1 132.08,31.75 133.35,33.02 IC105.4
OUT13
  Bottom 0.406: R314.1 135.89,33.02 IC105.5
OUT14
  Bottom 0.406: R315.1 144.78,31.75 143.51,33.02 139.7,33.02 138.43,34.29 IC105.6
OUT15
  Bottom 0.406: R316.1 151.13,33.02 149.86,34.29 142.24,34.29 140.97,35.56 IC105.7
SCL
  Bottom 0.406: IC102.6 IC101.1
SDA
  Bottom 0.406: IC102.5 IC101.2